# Altium schematic sheet Power_5v.SchDoc
size A4
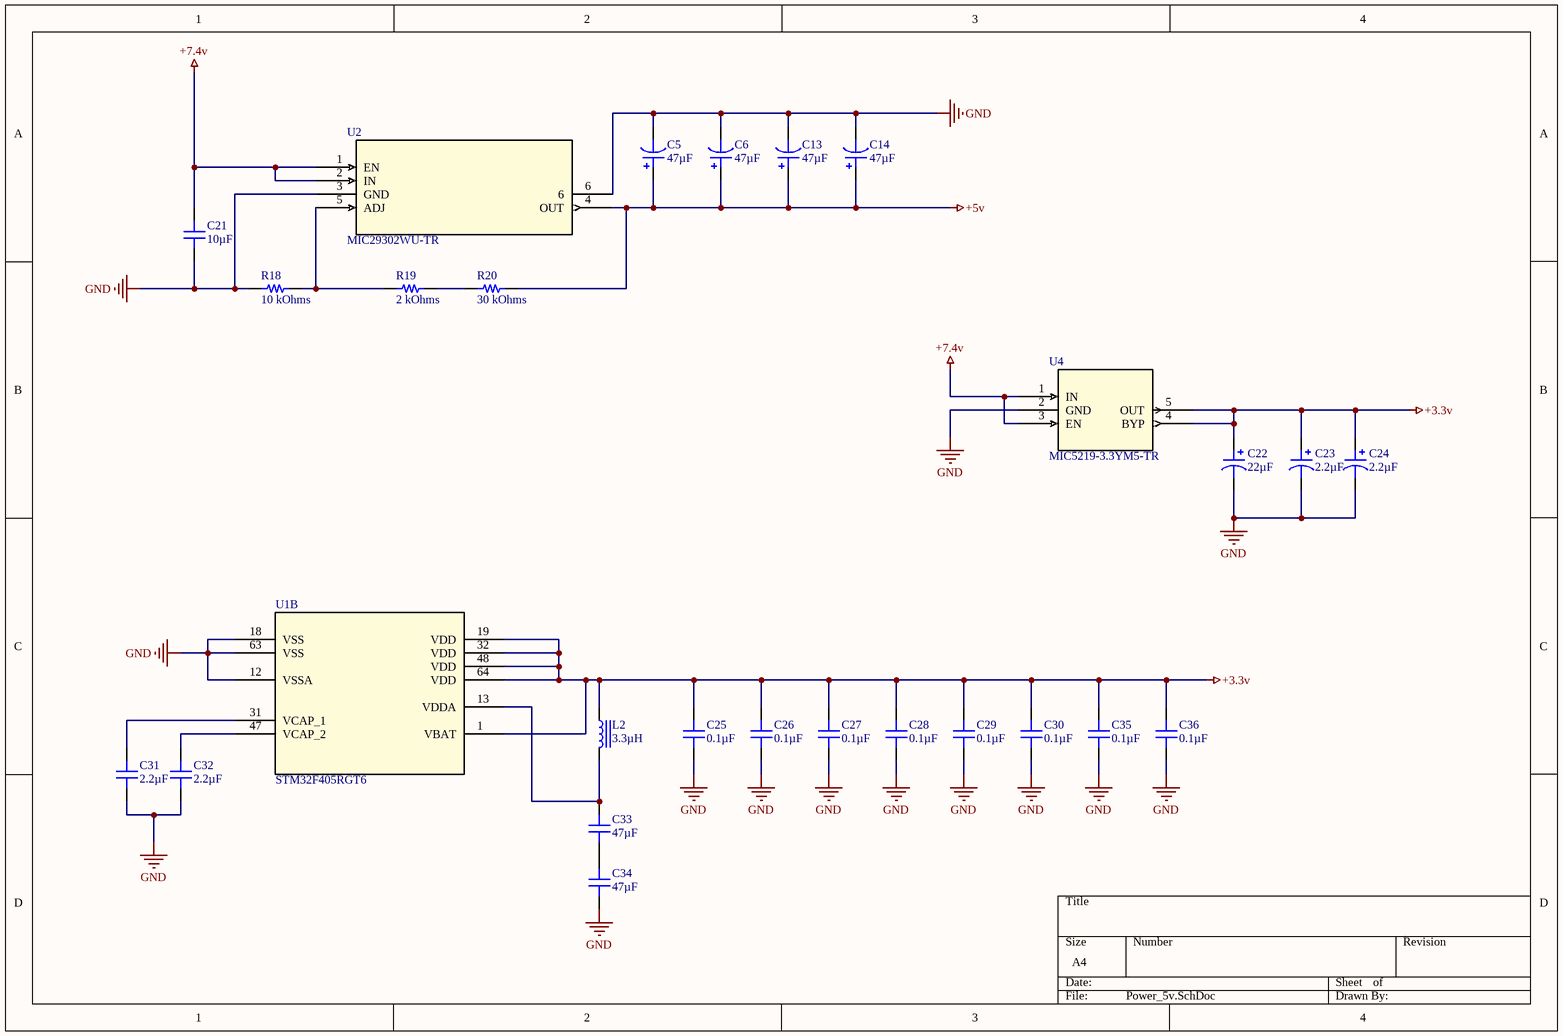
[diagram p0: Power_5v.SchDoc]

## Parts
C5  47µF  [CAP POL 1411_3528]
C6  47µF  [CAP POL 1411_3528]
C13  47µF  [CAP POL 1411_3528]
C14  47µF  [CAP POL 1411_3528]
C21  10µF  [CAP 0805_2012]
C22  22µF  [CAP POL 1411_3528]
C23  2.2µF  [CAP POL 1206_3216]
C24  2.2µF  [CAP POL 1206_3216]
C25  0.1µF  [CAP 0805_2012]
C26  0.1µF  [CAP 0805_2012]
C27  0.1µF  [CAP 0805_2012]
C28  0.1µF  [CAP 0805_2012]
C29  0.1µF  [CAP 0805_2012]
C30  0.1µF  [CAP 0805_2012]
C31  2.2µF  [CAP 0805_2012]
C32  2.2µF  [CAP 0805_2012]
C33  47µF  [CAP 0805_2012]
C34  47µF  [CAP 0805_2012]
C35  0.1µF  [CAP 0805_2012]
C36  0.1µF  [CAP 0805_2012]
L2  3.3µH  [IND 0806_2016]
R18  10 kOhms  [RES 0805_2012]
R19  2 kOhms  [RES 0805_2012]
R20  30 kOhms  [RES 0805_2012]
U1  STM32F405RGT6  [LQFP64-10x10mm]  (part B of 2)
U2  MIC29302WU-TR  [TO-263-5_MCH]
U4  MIC5219-3.3YM5-TR  [SOT-23-5_M5_MCH]

## Nets
+3.3v: C22.1 C23.1 C24.1 C25.2 C26.2 C27.2 C28.2 C29.2 C30.2 C35.2 C36.2 L2.1 U1.1(VBAT) U1.19(VDD) U1.32(VDD) U1.48(VDD) U1.64(VDD) U4.4(BYP) U4.5(OUT)
+5v: C5.1 C6.1 C13.1 C14.1 R20.2 U2.4(OUT)
+7.4v: C21.2 U2.1(EN) U2.2(IN) U4.1(IN) U4.3(EN)
GND: C5.2 C6.2 C13.2 C14.2 C21.1 C22.2 C23.2 C24.2 C25.1 C26.1 C27.1 C28.1 C29.1 C30.1 C31.1 C32.1 C34.1 C35.1 C36.1 R18.1 U1.12(VSSA) U1.18(VSS) U1.63(VSS) U2.3(GND) U2.6 U4.2(GND)
NetC31_2: C31.2 U1.31(VCAP_1)
NetC32_2: C32.2 U1.47(VCAP_2)
NetC33_1: C33.1 C34.2
NetC33_2: C33.2 L2.2 U1.13(VDDA)
NetR18_2: R18.2 R19.1 U2.5(ADJ)
NetR19_2: R19.2 R20.1

## Library data of the parts
C5 C6 C13 C14 = TPSB476K010R0250: CAP TANT 47UF 10% 10V 1411; Manufacturer: AVX Corporation; Manufacturer Size Code: B; ESR (Equivalent Series Resistance): 250mOhm; Type: Molded; Part Number: TPSB476K010R0250; Value: 47µF; Capacitance: 47µF; ComponentLink1Description: Datasheet; ComponentLink1URL: http://datasheets.avx.com/TPS.pdf; ComponentLink2Description: DigiKey Link; ComponentLink2URL: http://digikey.com/product-detail/en/avx-corporation/TPSB476K010R0250/478-3085-1-ND/809598; Features: General Purpose; Height - Seated (Max): 0.083" (2.10mm); LastUpdated: 02.09.2020 1:15:46; Lifecycle Status: Active; Minimum Order: 1; Mounting Type: Surface Mount; Operating Temperature: -55°C ~ 125°C; Package / Case: 1411 (3528 Metric), 1210; Packaging: TapeAndReel; PartId: 66; Part Status: Active; Price: 0.18; Series: TPS; Size / Dimension: 0.138" L x 0.110" W (3.50mm x 2.80mm); Supplier 1: DigiKey; Supplier Part Number 1: 478-3085-1-ND; Tolerance: ±10%; Voltage - Rated: 10V
C21 = C2012JB1E106M125AB: CAP CER 10UF 25V JB 0805; Manufacturer: TDK Corporation; Tolerance: ±20%; Part Number: C2012JB1E106M125AB; Value: 10µF; Applications: General Purpose; Capacitance: 10µF; ComponentLink1Description: Datasheet; ComponentLink1URL: https://product.tdk.com/info/en/catalog/datasheets/mlcc_commercial_general_en.pdf?ref_disty=digikey; ComponentLink2Description: DigiKey Link; ComponentLink2URL: http://digikey.com/product-detail/en/tdk-corporation/C2012JB1E106M125AB/445-11465-1-ND/3953131; Device Package: 0805 (2012 Metric); Features: Low ESL; LastUpdated: 02.09.2020 1:04:40; Lifecycle Status: Active; Minimum Order: 1; Mounting Type: Surface Mount, MLCC; Operating Temperature: -25°C ~ 85°C; Package / Case: 0805 (2012 Metric); Packaging: TapeAndReel; PartId: 3479; Part Status: Active; Price: 0.16; Series: C; Size / Dimension: 0.079" L x 0.049" W (2.00mm x 1.25mm); Supplier 1: DigiKey; Supplier Part Number 1: 445-11465-1-ND; Temperature Coefficient: JB; Thickness (Max): 0.057" (1.45mm); Voltage - Rated: 25V
C22 = T495B226K010ATE500: CAP TANT 22UF 10% 10V 1411; Manufacturer: KEMET; Manufacturer Size Code: B; ESR (Equivalent Series Resistance): 500mOhm @ 100kHz; Lifetime @ Temp.: 2000 Hrs @ 125°C; Type: Molded; Part Number: T495B226K010ATE500; Value: 22µF; Capacitance: 22µF; ComponentLink1Description: Datasheet; ComponentLink1URL: https://api.kemet.com/component-edge/download/datasheet/T495B226K010ATE500.pdf; ComponentLink2Description: DigiKey Link; ComponentLink2URL: http://digikey.com/product-detail/en/kemet/T495B226K010ATE500/399-18339-1-ND/9460195; Device Package: 1411 (3528 Metric); Features: General Purpose; Height - Seated (Max): 0.083" (2.10mm); LastUpdated: 02.09.2020 1:15:46; Lifecycle Status: Active; Minimum Order: 1; Mounting Type: Surface Mount; Operating Temperature: -55°C ~ 125°C; Package / Case: 1411 (3528 Metric); Packaging: TapeAndReel; PartId: 6; Part Status: Active; Price: 0.46; Series: T495; Size / Dimension: 0.138" L x 0.110" W (3.50mm x 2.80mm); Supplier 1: DigiKey; Supplier Part Number 1: 399-18339-1-ND; Tolerance: ±10%; Voltage - Rated: 10V
C23 C24 = T494A225K010AT: CAP TANT 2.2UF 10% 10V 1206; Manufacturer: KEMET; Manufacturer Size Code: A; ESR (Equivalent Series Resistance): 6Ohm; Lifetime @ Temp.: 2000 Hrs @ 125°C; Type: Molded; Part Number: T494A225K010AT; Value: 2.2µF; Capacitance: 2.2µF; ComponentLink1Description: Datasheet; ComponentLink1URL: https://api.kemet.com/component-edge/download/datasheet/T494A225K010AT.pdf; ComponentLink2Description: DigiKey Link; ComponentLink2URL: http://digikey.com/product-detail/en/kemet/T494A225K010AT/399-3826-1-ND/819151; Device Package: 1206 (3216 Metric); Features: General Purpose; Height - Seated (Max): 0.071" (1.80mm); LastUpdated: 02.09.2020 1:15:55; Lifecycle Status: Active; Minimum Order: 1; Mounting Type: Surface Mount; Operating Temperature: -55°C ~ 125°C; Package / Case: 1206 (3216 Metric); Packaging: TapeAndReel; PartId: 1334; Part Status: Active; Price: 0.20; Series: T494; Size / Dimension: 0.126" L x 0.063" W (3.20mm x 1.60mm); Supplier 1: DigiKey; Supplier Part Number 1: 399-3826-1-ND; Tolerance: ±10%; Voltage - Rated: 10V
C25-C30 C35 C36 = CC0805MRX7R9BB104: CAP CER 0.1UF 50V X7R 0805; Manufacturer: Yageo; Tolerance: ±20%; Part Number: CC0805MRX7R9BB104; Value: 0.1µF; Applications: General Purpose; Capacitance: 0.1µF; ComponentLink1Description: Datasheet; ComponentLink1URL: https://www.yageo.com/upload/media/product/productsearch/datasheet/mlcc/UPY-GPHC_X7R_6.3V-to-50V_18.pdf; ComponentLink2Description: DigiKey Link; ComponentLink2URL: http://digikey.com/product-detail/en/yageo/CC0805MRX7R9BB104/311-4351-1-ND/8025440; Device Package: 0805 (2012 Metric); LastUpdated: 9/2/2020 1:04:42 AM; Lifecycle Status: Active; Minimum Order: 1; Mounting Type: Surface Mount, MLCC; Operating Temperature: -55°C ~ 125°C; Package / Case: 0805 (2012 Metric); Packaging: TapeAndReel; PartId: 2475; Part Status: Active; Price: 0.02; Series: CC; Size / Dimension: 0.079" L x 0.049" W (2.00mm x 1.25mm); Supplier 1: DigiKey; Supplier Part Number 1: 311-4351-1-ND; Temperature Coefficient: X7R; Thickness (Max): 0.037" (0.95mm); Voltage - Rated: 50V
C31 C32 = C0805C225K9RACTU: CAP CER 2.2UF 6.3V X7R 0805; Manufacturer: KEMET; Tolerance: ±10%; Part Number: C0805C225K9RACTU; Value: 2.2µF; Applications: Bypass, Decoupling; Capacitance: 2.2µF; ComponentLink1Description: Datasheet; ComponentLink1URL: https://api.kemet.com/component-edge/download/datasheet/C0805C225K9RACTU.pdf; ComponentLink2Description: DigiKey Link; ComponentLink2URL: http://digikey.com/product-detail/en/kemet/C0805C225K9RACTU/399-4936-1-ND/1090931; Device Package: 0805 (2012 Metric); LastUpdated: 9/2/2020 1:04:41 AM; Lifecycle Status: Active; Minimum Order: 1; Mounting Type: Surface Mount, MLCC; Operating Temperature: -55°C ~ 125°C; Package / Case: 0805 (2012 Metric); Packaging: TapeAndReel; PartId: 2800; Part Status: Active; Price: 0.08; Series: SMD Comm X7R; Size / Dimension: 0.079" L x 0.049" W (2.00mm x 1.25mm); Supplier 1: DigiKey; Supplier Part Number 1: 399-4936-1-ND; Temperature Coefficient: X7R; Thickness (Max): 0.055" (1.40mm); Voltage - Rated: 6.3V
C33 C34 = GRM21BR61A476ME15L: CAP CER 47UF 10V X5R 0805; Manufacturer: Murata Electronics; Tolerance: ±20%; Part Number: GRM21BR61A476ME15L; Value: 47µF; Applications: General Purpose; Capacitance: 47µF; ComponentLink1Description: Datasheet; ComponentLink1URL: https://search.murata.co.jp/Ceramy/image/img/A01X/G101/ENG/GRM21BR61A476ME15-01.pdf; ComponentLink2Description: DigiKey Link; ComponentLink2URL: http://digikey.com/product-detail/en/murata-electronics/GRM21BR61A476ME15L/490-9961-1-ND/5026442; Device Package: 0805 (2012 Metric); LastUpdated: 02.09.2020 1:04:38; Lifecycle Status: Active; Minimum Order: 1; Mounting Type: Surface Mount, MLCC; Operating Temperature: -55°C ~ 85°C; Package / Case: 0805 (2012 Metric); Packaging: TapeAndReel; PartId: 4627; Part Status: Active; Price: 0.19; Series: GRM; Size / Dimension: 0.079" L x 0.049" W (2.00mm x 1.25mm); Supplier 1: DigiKey; Supplier Part Number 1: 490-9961-1-ND; Temperature Coefficient: X5R; Thickness (Max): 0.057" (1.45mm); Voltage - Rated: 10V
L2 = 74479776233: FIXED IND 3.3UH 1.1A 130 MOHM; Manufacturer: Würth Elektronik; Current - Saturation: 300mA; Frequency - Self Resonant: 60MHz; Inductance Frequency - Test: 1MHz; Material - Core: 0806 (2016 Metric); Q @ Freq: 10 @ 1MHz; Shielding: Shielded; Tolerance: ±20%; Type: Multilayer; Part Number: 74479776233; ComponentLink1Description: Datasheet; ComponentLink1URL: https://katalog.we-online.de/pbs/datasheet/74479776233.pdf; ComponentLink2Description: DigiKey Link; ComponentLink2URL: http://digikey.com/product-detail/en/w-rth-elektronik/74479776233/732-2955-1-ND/2524827; Current Rating (Amps): 1.1A; DC Resistance (DCR): 130mOhm; Device Package: 0806 (2016 Metric); Height - Seated (Max): 0.039" (1.00mm); Inductance: 3.3µH; LastUpdated: 02.09.2020 1:24:34; Lifecycle Status: Active; Minimum Order: 1; Mounting Type: Surface Mount; Operating Temperature: -40°C ~ 125°C; Package / Case: 0806 (2016 Metric); Packaging: TapeAndReel; PartId: 3067; Part Status: Active; Price: 0.54; Series: WE-PMI; Size / Dimension: 0.079" L x 0.063" W (2.00mm x 1.60mm); Supplier 1: DigiKey; Supplier Part Number 1: 732-2955-1-ND; Supplier Device Package: 0806 (2016 Metric); Value: 3.3µH
R18 = CRGCQ0805F10K: CRGCQ 0805 10K 1%; Manufacturer: TE Connectivity Passive Product; Power (Watts): 0.125W, 1/8W; Temperature Coefficient: ±100ppm/°C; Part Number: CRGCQ0805F10K; Value: 10 kOhms; ComponentLink1Description: Datasheet; ComponentLink1URL: https://www.te.com/commerce/DocumentDelivery/DDEController?Action=srchrtrv&DocNm=1773204-3&DocType=DS&DocLang=English; ComponentLink2Description: DigiKey Link; ComponentLink2URL: http://digikey.com/product-detail/en/te-connectivity-passive-product/CRGCQ0805F10K/A129761CT-ND/8577593; Composition: Thick Film; Device Package: 0805 (2012 Metric); Features: Automotive AEC-Q200, Moisture Resistant; Height - Seated (Max): 0.026" (0.65mm); LastUpdated: 02.09.2020 1:14:36; Lifecycle Status: Active; Minimum Order: 1; Number of Terminations: 2; Operating Temperature: -55°C ~ 155°C; Package / Case: 0805 (2012 Metric); Packaging: TapeAndReel; PartId: 47653; Part Status: Active; Price: 0.01; Ratings: AEC-Q200; Resistance: 10 kOhms; Series: CRGCQ; Size / Dimension: 0.079" L x 0.049" W (2.00mm x 1.25mm); Supplier 1: DigiKey; Supplier Part Number 1: A129761CT-ND; Supplier Device Package: 0805; Tolerance: ±1%
R19 = TNPW08052K00FEEA: RES 2K OHM 1% 1/8W 0805; Manufacturer: Vishay Dale; Power (Watts): 0.2W, 1/5W; Temperature Coefficient: ±25ppm/°C; Part Number: TNPW08052K00FEEA; Value: 2 kOhms; ComponentLink1Description: Datasheet; ComponentLink1URL: http://www.vishay.com/docs/28758/tnpw_e3.pdf; ComponentLink2Description: DigiKey Link; ComponentLink2URL: http://digikey.com/product-detail/en/vishay-dale/TNPW08052K00FEEA/541-3918-1-ND/7355276; Composition: Thin Film; Device Package: 0805 (2012 Metric); Features: Anti-Sulfur, Automotive AEC-Q200, Moisture Resistant; Height - Seated (Max): 0.022" (0.55mm); LastUpdated: 02.09.2020 1:15:11; Lifecycle Status: Active; Minimum Order: 1; Number of Terminations: 2; Operating Temperature: -55°C ~ 155°C; Package / Case: 0805 (2012 Metric); Packaging: TapeAndReel; PartId: 33621; Part Status: Active; Price: 0.05; Ratings: AEC-Q200; Resistance: 2 kOhms; Series: TNPW e3; Size / Dimension: 0.079" L x 0.049" W (2.00mm x 1.25mm); Supplier 1: DigiKey; Supplier Part Number 1: 541-3918-1-ND; Supplier Device Package: 0805; Tolerance: ±1%
R20 = RMCF0805FT30K0: RES 30K OHM 1% 1/8W 0805; Manufacturer: Stackpole Electronics Inc; Power (Watts): 0.125W, 1/8W; Temperature Coefficient: ±100ppm/°C; Part Number: RMCF0805FT30K0; Value: 30 kOhms; ComponentLink1Description: Datasheet; ComponentLink1URL: https://www.seielect.com/catalog/sei-rmcf_rmcp.pdf; ComponentLink2Description: DigiKey Link; ComponentLink2URL: http://digikey.com/product-detail/en/stackpole-electronics-inc/RMCF0805FT30K0/RMCF0805FT30K0CT-ND/7906793; Composition: Thick Film; Device Package: 0805 (2012 Metric); Features: Automotive AEC-Q200; Height - Seated (Max): 0.026" (0.65mm); LastUpdated: 02.09.2020 1:14:43; Lifecycle Status: Active; Minimum Order: 1; Number of Terminations: 2; Operating Temperature: -55°C ~ 155°C; Package / Case: 0805 (2012 Metric); Packaging: CutTape; PartId: 45910; Part Status: Active; Price: 0.10; Ratings: AEC-Q200; Resistance: 30 kOhms; Series: RMCF; Size / Dimension: 0.079" L x 0.049" W (2.00mm x 1.25mm); Supplier 1: DigiKey; Supplier Part Number 1: RMCF0805FT30K0CT-ND; Supplier Device Package: 0805; Tolerance: ±1%
U1 = STM32F405RGT6: No Description Available; Vendor: STMicroelectronics; Built_By: EMA_UL_Team; SourceLibrary: Updates_to_database_2020-10-19; Manufacturer_Part_Number: STM32F405RGT6; Copyright: Copyright (C) 2018 Accelerated Designs. All rights reserved; RefDes: RefDes; Type: DEV
U2 = MIC29302WU-TR: No Description Available; Mfr_Name: Microchip; Copyright: Copyright (C) 2022 Ultra Librarian. All rights reserved.; Manufacturer_Part_Number: MIC29302WU-TR; RefDes: RefDes; Type: DEV
U4 = MIC5219-3.3YM5-TR: No Description Available; Vendor: Microchip; Built_By: EMA_Jessica; SourceLibrary: Microchip_2019-08-23_3; Manufacturer_Part_Number: MIC5219-3.3YM5-TR; Copyright: Copyright (C) 2018 Accelerated Designs. All rights reserved; RefDes: RefDes; Type: DEV